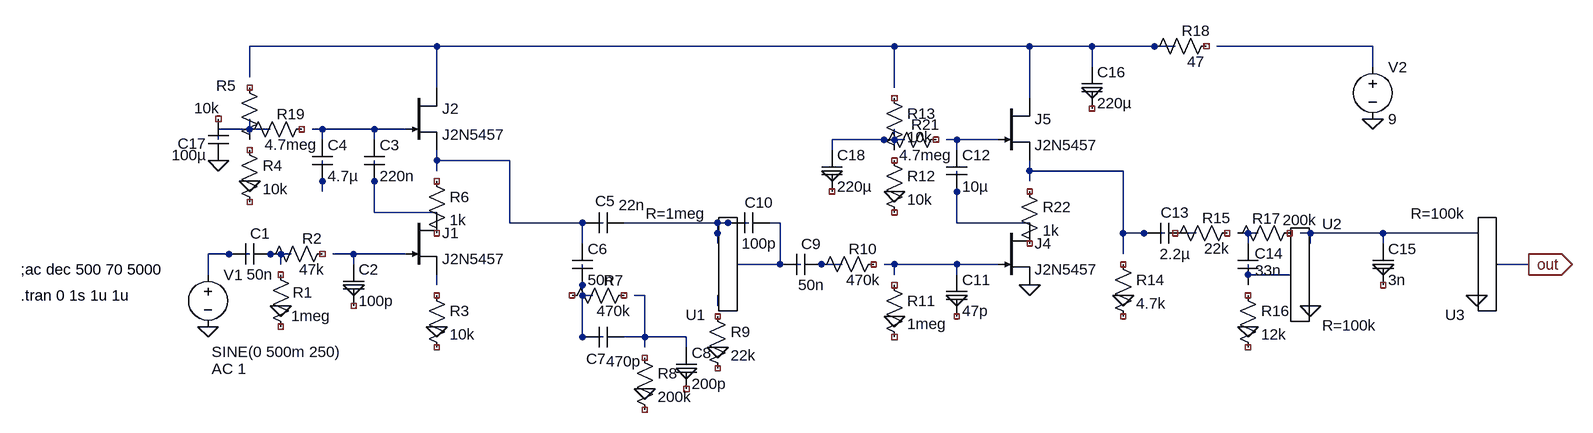
[diagram p0: schematic dirty_little_secret.asc]
dirty_little_secret.asc, the LTspice schematic file:
Version 4
SHEET 1 2272 680
WIRE 496 -192 208 -192
WIRE 1200 -192 496 -192
WIRE 1408 -192 1200 -192
WIRE 1504 -192 1408 -192
WIRE 1632 -192 1504 -192
WIRE 1936 -192 1696 -192
WIRE 1504 -160 1504 -192
WIRE 1936 -160 1936 -192
WIRE 208 -144 208 -192
WIRE 496 -128 496 -192
WIRE 1200 -128 1200 -192
WIRE 1408 -112 1408 -192
WIRE 208 -64 208 -80
WIRE 208 -64 160 -64
WIRE 240 -64 208 -64
WIRE 320 -64 304 -64
WIRE 400 -64 320 -64
WIRE 448 -64 400 -64
WIRE 160 -48 160 -64
WIRE 208 -48 208 -64
WIRE 320 -48 320 -64
WIRE 400 -48 400 -64
WIRE 1200 -48 1200 -64
WIRE 1200 -48 1104 -48
WIRE 1216 -48 1200 -48
WIRE 1296 -48 1280 -48
WIRE 1360 -48 1296 -48
WIRE 1104 -32 1104 -48
WIRE 1200 -32 1200 -48
WIRE 1296 -32 1296 -48
WIRE 496 -16 496 -32
WIRE 608 -16 496 -16
WIRE 496 0 496 -16
WIRE 1408 0 1408 -16
WIRE 1552 0 1408 0
WIRE 1408 16 1408 0
WIRE 320 32 320 -16
WIRE 400 64 400 -16
WIRE 496 64 400 64
WIRE 608 80 608 -16
WIRE 720 80 608 80
WIRE 752 80 720 80
WIRE 928 80 784 80
WIRE 976 80 928 80
WIRE 1024 80 1008 80
WIRE 1296 80 1296 0
WIRE 1408 80 1296 80
WIRE 928 96 928 80
WIRE 1552 96 1552 0
WIRE 1616 96 1552 96
WIRE 1664 96 1648 96
WIRE 1744 96 1728 96
WIRE 1760 96 1744 96
WIRE 1840 96 1824 96
WIRE 1952 96 1840 96
WIRE 2096 96 1952 96
WIRE 720 112 720 80
WIRE 928 112 928 96
WIRE 1744 112 1744 96
WIRE 1840 112 1840 96
WIRE 1952 112 1952 96
WIRE 208 128 144 128
WIRE 256 128 240 128
WIRE 272 128 256 128
WIRE 368 128 336 128
WIRE 448 128 368 128
WIRE 1552 128 1552 96
WIRE 256 144 256 128
WIRE 368 144 368 128
WIRE 1024 144 1024 80
WIRE 1024 144 960 144
WIRE 1056 144 1024 144
WIRE 1120 144 1088 144
WIRE 1200 144 1184 144
WIRE 1296 144 1200 144
WIRE 1360 144 1296 144
WIRE 2176 144 2128 144
WIRE 144 160 144 128
WIRE 1200 160 1200 144
WIRE 1296 160 1296 144
WIRE 1744 160 1744 144
WIRE 1808 160 1744 160
WIRE 496 176 496 160
WIRE 1744 176 1744 160
WIRE 720 192 720 144
WIRE 736 192 720 192
WIRE 816 192 800 192
WIRE 928 208 928 192
WIRE 720 256 720 192
WIRE 752 256 720 256
WIRE 816 256 816 192
WIRE 816 256 784 256
WIRE 880 256 816 256
WIRE 816 272 816 256
WIRE 880 272 880 256
FLAG 144 240 0
FLAG 256 208 0
FLAG 368 176 0
FLAG 496 240 0
FLAG 208 16 0
FLAG 816 336 0
FLAG 880 304 0
FLAG 928 272 0
FLAG 1200 224 0
FLAG 1296 192 0
FLAG 1408 176 0
FLAG 1200 32 0
FLAG 1552 192 0
FLAG 1744 240 0
FLAG 1840 208 0
FLAG 1952 144 0
FLAG 2096 192 0
FLAG 2176 144 out
IOPIN 2176 144 Out
FLAG 1936 -80 0
FLAG 160 -16 0
FLAG 1104 0 0
FLAG 1504 -128 0
SYMBOL voltage 144 144 R0
WINDOW 3 6 135 Left 0
WINDOW 123 6 161 Left 0
WINDOW 39 0 0 Left 0
SYMATTR Value SINE(0 500m 250)
SYMATTR Value2 AC 1
SYMATTR InstName V1
SYMBOL voltage 1936 -176 R0
WINDOW 123 0 0 Left 0
WINDOW 39 0 0 Left 0
SYMATTR InstName V2
SYMATTR Value 9
SYMBOL cap 240 112 R90
WINDOW 0 0 16 VBottom 0
WINDOW 3 32 16 VTop 0
SYMATTR InstName C1
SYMATTR Value 50n
SYMBOL res 240 144 R0
WINDOW 0 34 43 Left 0
WINDOW 3 32 79 Left 0
SYMATTR InstName R1
SYMATTR Value 1meg
SYMBOL res 336 112 R90
WINDOW 0 8 32 VBottom 0
WINDOW 3 24 32 VTop 0
SYMATTR InstName R2
SYMATTR Value 47k
SYMBOL cap 352 144 R0
SYMATTR InstName C2
SYMATTR Value 100p
SYMBOL njf 448 64 R0
SYMATTR InstName J1
SYMATTR Value J2N5457
SYMBOL res 480 176 R0
SYMATTR InstName R3
SYMATTR Value 10k
SYMBOL njf 448 -128 R0
SYMATTR InstName J2
SYMATTR Value J2N5457
SYMBOL cap 384 -48 R0
SYMATTR InstName C3
SYMATTR Value 220n
SYMBOL cap 304 -48 R0
SYMATTR InstName C4
SYMATTR Value 4.7µ
SYMBOL res 192 -48 R0
SYMATTR InstName R4
SYMATTR Value 10k
SYMBOL res 192 -144 R0
WINDOW 0 -35 13 Left 0
WINDOW 3 -69 47 Left 0
SYMATTR InstName R5
SYMATTR Value 10k
SYMBOL cap 784 64 R90
WINDOW 0 -2 29 VBottom 0
WINDOW 3 -27 -12 VTop 0
SYMATTR InstName C5
SYMATTR Value 22n
SYMBOL cap 704 112 R0
SYMATTR InstName C6
SYMATTR Value 50n
SYMBOL res 800 176 R90
WINDOW 0 8 32 VBottom 0
WINDOW 3 24 32 VTop 0
SYMATTR InstName R7
SYMATTR Value 470k
SYMBOL cap 784 240 R90
WINDOW 0 65 43 VBottom 0
WINDOW 3 38 0 VTop 0
SYMATTR InstName C7
SYMATTR Value 470p
SYMBOL res 800 272 R0
SYMATTR InstName R8
SYMATTR Value 200k
SYMBOL cap 864 272 R0
SYMATTR InstName C8
SYMATTR Value 200p
SYMBOL res 912 208 R0
SYMATTR InstName R9
SYMATTR Value 22k
SYMBOL cap 1088 128 R90
WINDOW 0 0 16 VBottom 0
WINDOW 3 32 16 VTop 0
SYMATTR InstName C9
SYMATTR Value 50n
SYMBOL cap 1008 64 R90
WINDOW 0 0 16 VBottom 0
WINDOW 3 32 16 VTop 0
SYMATTR InstName C10
SYMATTR Value 100p
SYMBOL res 1184 128 R90
WINDOW 0 8 32 VBottom 0
WINDOW 3 24 32 VTop 0
SYMATTR InstName R10
SYMATTR Value 470k
SYMBOL res 1184 160 R0
SYMATTR InstName R11
SYMATTR Value 1meg
SYMBOL cap 1280 160 R0
SYMATTR InstName C11
SYMATTR Value 47p
SYMBOL njf 1360 80 R0
SYMATTR InstName J4
SYMATTR Value J2N5457
SYMBOL njf 1360 -112 R0
SYMATTR InstName J5
SYMATTR Value J2N5457
SYMBOL cap 1280 -32 R0
SYMATTR InstName C12
SYMATTR Value 10µ
SYMBOL res 1184 -32 R0
SYMATTR InstName R12
SYMATTR Value 10k
SYMBOL res 1184 -128 R0
SYMATTR InstName R13
SYMATTR Value 10k
SYMBOL res 1536 128 R0
SYMATTR InstName R14
SYMATTR Value 4.7k
SYMBOL cap 1648 80 R90
WINDOW 0 0 16 VBottom 0
WINDOW 3 32 16 VTop 0
SYMATTR InstName C13
SYMATTR Value 2.2µ
SYMBOL res 1728 80 R90
WINDOW 0 8 32 VBottom 0
WINDOW 3 24 32 VTop 0
SYMATTR InstName R15
SYMATTR Value 22k
SYMBOL cap 1728 112 R0
WINDOW 0 26 15 Left 0
WINDOW 3 27 41 Left 0
SYMATTR InstName C14
SYMATTR Value 33n
SYMBOL res 1728 176 R0
SYMATTR InstName R16
SYMATTR Value 12k
SYMBOL EXTRA\\Misc\\pot 1840 160 R0
SYMATTR InstName U2
SYMATTR Value R=100k
SYMBOL res 1824 80 R90
WINDOW 0 9 51 VBottom 0
WINDOW 3 -20 0 VTop 0
SYMATTR InstName R17
SYMATTR Value 200k
SYMBOL cap 1936 112 R0
SYMATTR InstName C15
SYMATTR Value 3n
SYMBOL EXTRA\\Misc\\pot 2096 144 R180
SYMATTR InstName U3
SYMATTR Value R=100k
SYMATTR Value2 T=.05
SYMBOL res 1696 -208 R90
WINDOW 0 8 32 VBottom 0
WINDOW 3 24 32 VTop 0
SYMATTR InstName R18
SYMATTR Value 47
SYMBOL cap 1488 -160 R0
SYMATTR InstName C16
SYMATTR Value 220µ
SYMBOL EXTRA\\Misc\\pot 928 144 R180
SYMATTR InstName U1
SYMATTR Value R=1meg
SYMATTR Value2 T=.1
SYMBOL res 480 0 R0
SYMATTR InstName R6
SYMATTR Value 1k
SYMBOL res 304 -80 R90
WINDOW 0 8 32 VBottom 0
WINDOW 3 24 32 VTop 0
SYMATTR InstName R19
SYMATTR Value 4.7meg
SYMBOL cap 176 -16 R180
WINDOW 0 34 26 Left 0
WINDOW 3 34 8 Left 0
SYMATTR InstName C17
SYMATTR Value 100µ
SYMBOL res 1280 -64 R90
WINDOW 0 8 32 VBottom 0
WINDOW 3 24 32 VTop 0
SYMATTR InstName R21
SYMATTR Value 4.7meg
SYMBOL cap 1088 -32 R0
SYMATTR InstName C18
SYMATTR Value 220µ
SYMBOL res 1392 16 R0
SYMATTR InstName R22
SYMATTR Value 1k
TEXT -144 152 Left 0 !;ac dec 500 70 5000
TEXT -144 192 Left 0 !.tran 0 1s 1u 1u

The netlist it stands for:
* dirty_little_secret.asc
V1 N017 0 SINE(0 500m 250) AC 1
V2 N002 0 9
C1 N018 N017 50n
R1 NC_01 NC_02 1meg
R2 NC_03 N018 47k
C2 N019 NC_04 100p
J1 N010 N019 N023 J2N5457
R3 NC_05 NC_06 10k
J2 N001 N004 N007 J2N5457
C3 N004 N010 220n
C4 N004 N009 4.7µ
R4 NC_07 NC_08 10k
R5 NC_09 N003 10k
C5 N011 N007 22n
C6 N007 N024 50n
R7 NC_10 NC_11 470k
C7 N025 N024 470p
R8 NC_12 NC_13 200k
C8 N025 NC_14 200p
R9 NC_15 NC_16 22k
C9 N020 N012 50n
C10 N012 N011 100p
R10 NC_17 N020 470k
R11 NC_18 NC_19 1meg
C11 N021 NC_20 47p
J4 N013 N021 0 J2N5457
J5 N001 N006 N008 J2N5457
C12 N006 N013 10µ
R12 NC_21 NC_22 10k
R13 NC_23 N005 10k
R14 NC_24 NC_25 4.7k
C13 N014 N008 2.2µ
R15 NC_26 NC_27 22k
C14 N015 N022 33n
R16 NC_28 NC_29 12k
XU2 N016 0 N022 R=100k
R17 NC_30 N015 200k
C15 N016 NC_31 3n
XU3 0 N016 out R=100k T=.05
R18 NC_32 N001 47
C16 N001 NC_33 220µ
XU1 N026 N011 N012 R=1meg T=.1
R6 NC_34 NC_35 1k
R19 NC_36 N003 4.7meg
C17 0 NC_37 100µ
R21 NC_38 N005 4.7meg
C18 N005 NC_39 220µ
R22 NC_40 NC_41 1k
.model NJF NJF
.model PJF PJF
.lib standard.jft
;ac dec 500 70 5000
.tran 0 1s 1u 1u
.lib POT.lib
.backanno
.end